# Altium schematic sheet PCB Schematic General Sheet.SchDoc: PCB Schematic General
size A3; DrawnBy: Group 31; Address1: ECE Department; Address2: University of Canterbury; Address3: Christchurch 8041; Address4: New Zealand; Revision: 1
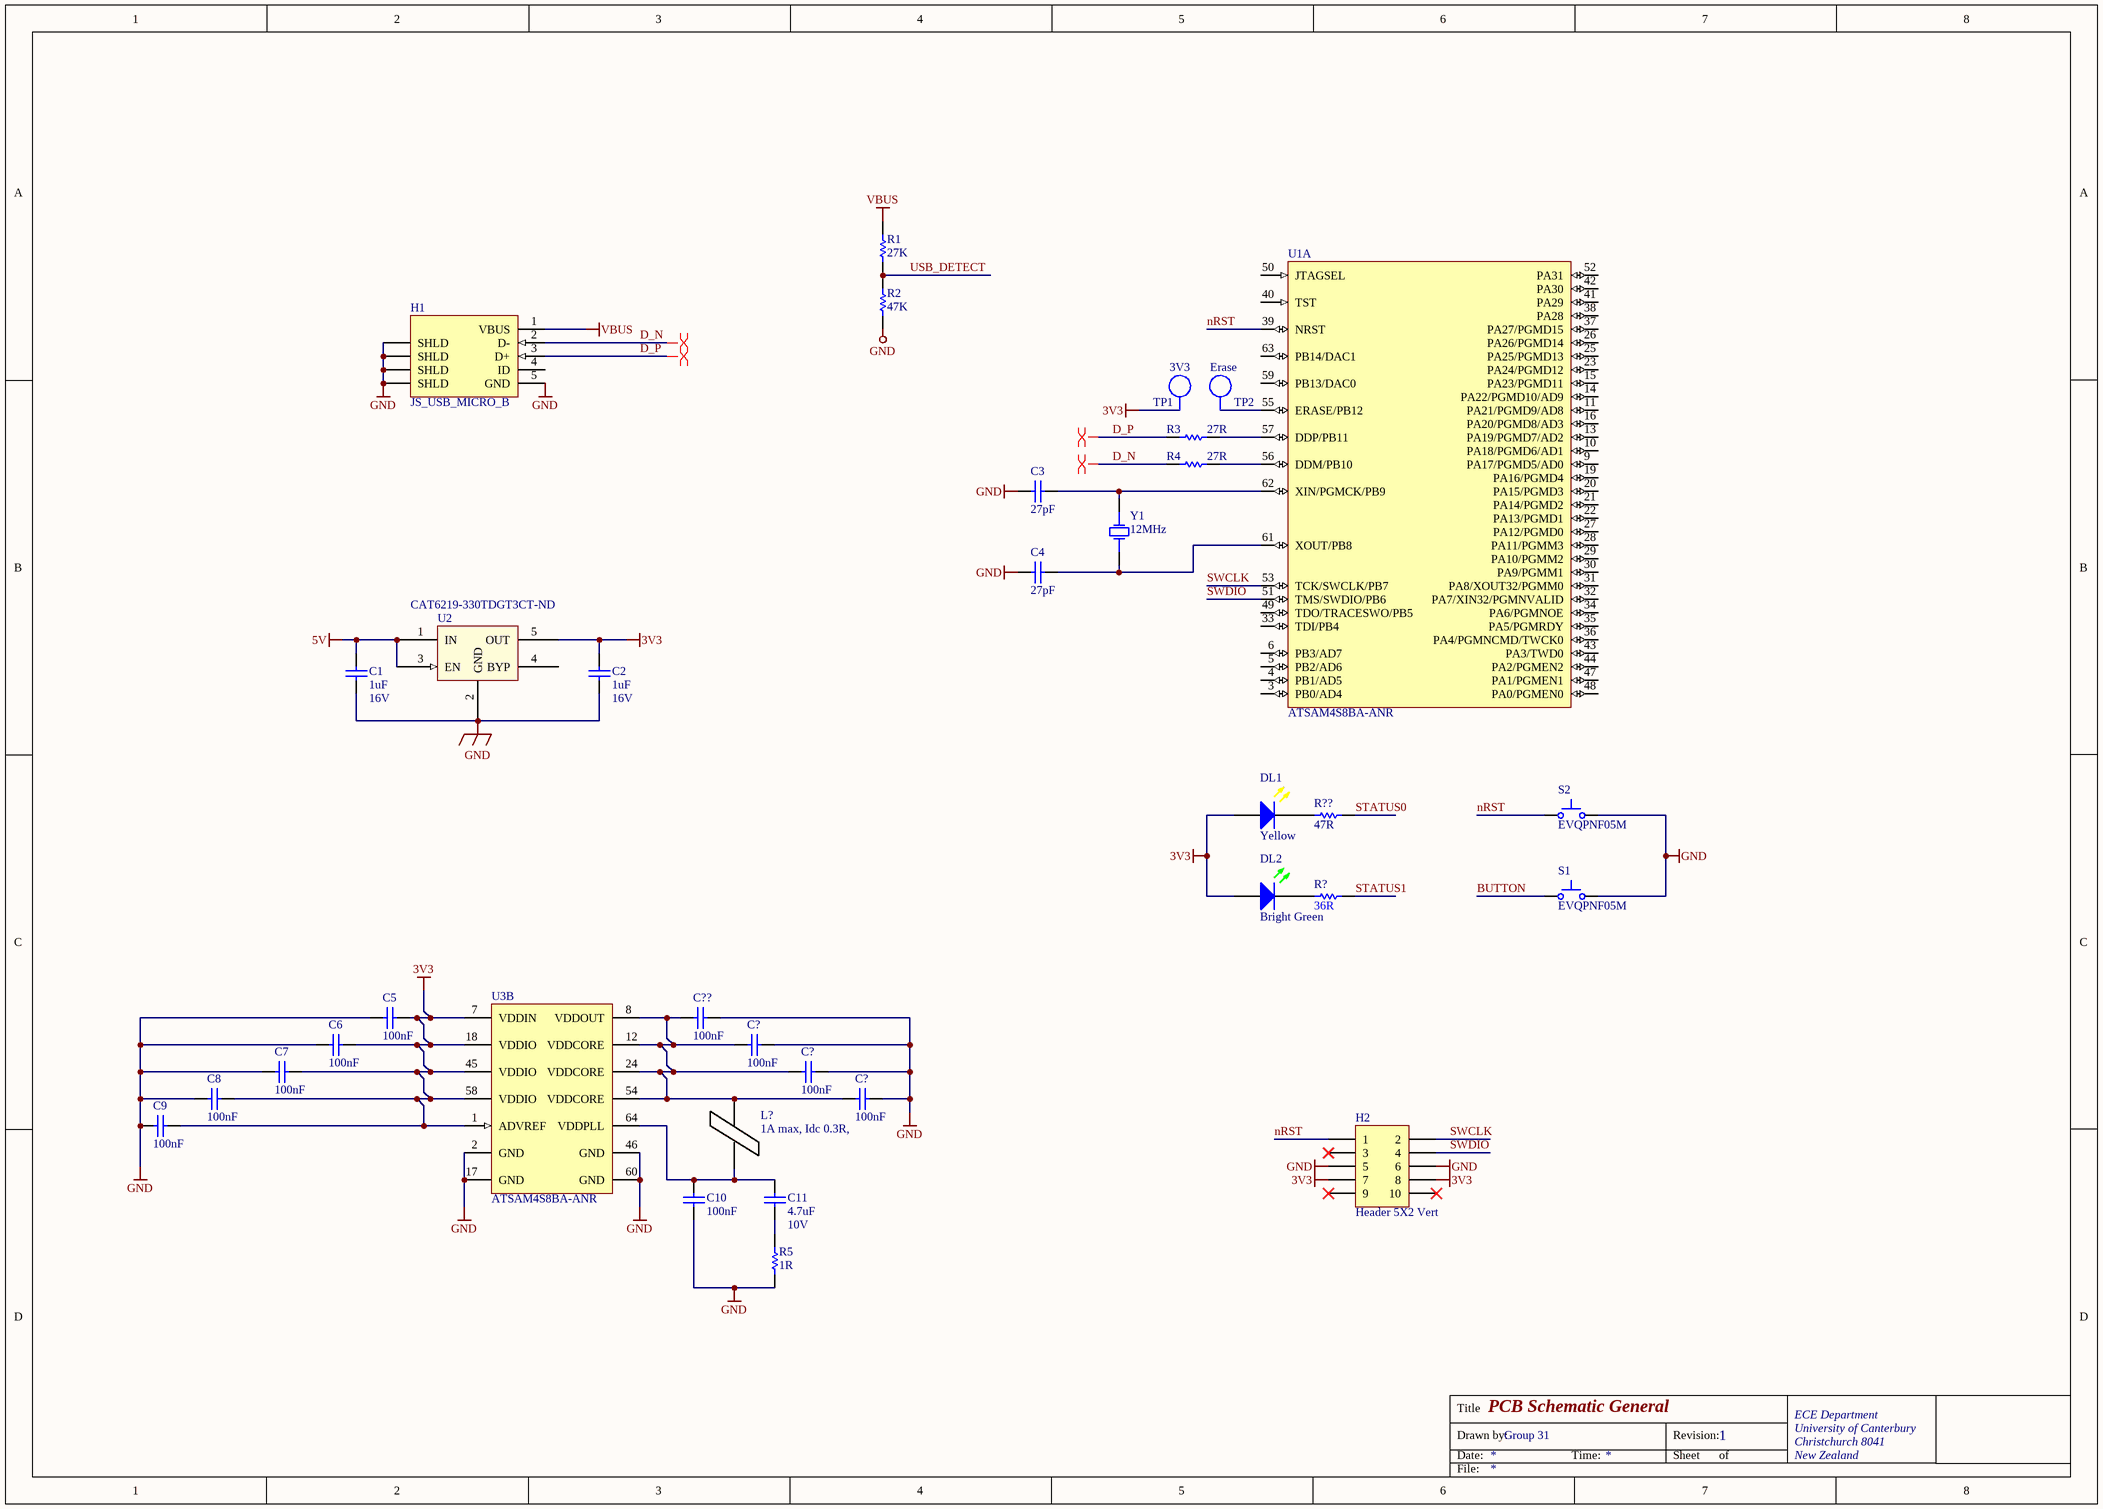
[diagram p0: PCB Schematic General Sheet.SchDoc]

## Parts
(Parts that share a designator on the sheet are numbered #1, #2 ... from top to bottom, then left to right.)
C1  Max Voltage: 16V  [CAPC1608L]  (hidden comment: 1uF)
C2  Max Voltage: 16V  [CAPC1608L]  (hidden comment: 1uF)
C3  27pF  [CAPC1608L]
C4  27pF  [CAPC1608L]
C5  100nF  [CAPC1608L]
C6  100nF  [CAPC1608L]
C7  100nF  [CAPC1608L]
C8  100nF  [CAPC1608L]
C9  100nF  [CAPC1608L]
C10  100nF  [CAPC1608L]
C11  Max Voltage: 10V  [CAPC1608N]  (hidden comment: 4.7uF)
C?#1  100nF  [CAPC1608L]
C?#2  100nF  [CAPC1608L]
C?#3  100nF  [CAPC1608L]
C??  100nF  [CAPC1608L]
DL1  Yellow  [WL-SMCW0603]
DL2  Bright Green  [WL-SMCW0603]
H1  JS_USB_MICRO_B  [FCI_USB_10118194-0001LF]
H2  Header 5X2 Vert  [IDC2.54-V10D]
L?  1A max, Idc 0.3R,  [INDC3216L]
R1  27K  [RESC1608L]
R2  47K  [RESC1608N]
R3  27R  [RESC1608L]
R4  27R  [RESC1608L]
R5  1R  [RESC3216L]
R?  36R  [RESC1608L]
R??  47R  [RESC1608L]
S1  EVQPNF05M  [EVQPNF05M]
S2  EVQPNF05M  [EVQPNF05M]
TP1  3V3  [TP_1206]  (no BOM)
TP2  Erase  [TP_1206]  (no BOM)
U1  ATSAM4S8BA-ANR  [LQFP64_L]  (part A of 2)
U2  Supplier Part Number: CAT6219-330TDGT3CT-ND  [SOT95P280X145-5N]  (hidden comment: CAT6219-330TDGT3)
U3  ATSAM4S8BA-ANR  [LQFP64_L]  (part B of 2)
Y1  12MHz  [6.0X3.5-4]

## Nets
3V3: C2.2 C5.2 C6.2 C7.2 C8.2 C9.2 DL1.2(A) DL2.2(A) H2.7 H2.8 TP1.1 U2.5(OUT) U3.1(ADVREF) U3.7(VDDIN) U3.18(VDDIO) U3.45(VDDIO) U3.58(VDDIO)
5V: C1.2 U2.1(IN) U2.3(EN)
GND: C1.1 C2.1 C3.1 C4.1 C5.1 C6.1 C7.1 C8.1 C9.1 C10.1 C?#1.2 C?#2.2 C?#3.2 C??.2 H1.5(GND) H1.6(SHLD) H2.5 H2.6 R2.1 R5.1 S1.2 S2.2 U2.2(GND) U3.2(GND) U3.17(GND) U3.46(GND) U3.60(GND)
VBUS: H1.1(VBUS) R1.2
BUTTON: S1.1
D_N: H1.2(D-) R4.1
D_P: H1.3(D+) R3.1
nRST: H2.1 S2.1 U1.39(NRST)
STATUS0: R??.2
STATUS1: R?.2
SWCLK: H2.2 U1.53(TCK/SWCLK/PB7)
SWDIO: H2.4 U1.51(TMS/SWDIO/PB6)
USB_DETECT: R1.1 R2.2
NetC3_2: C3.2 U1.62(XIN/PGMCK/PB9) Y1.1(OSC1)
NetC4_2: C4.2 U1.61(XOUT/PB8) Y1.3(OSC2)
NetC10_2: C10.2 C11.2 L?.1 U3.64(VDDPLL)
NetC11_1: C11.1 R5.2
NetC?#1_1: C?#1.1 C?#2.1 C?#3.1 C??.1 L?.2 U3.8(VDDOUT) U3.12(VDDCORE) U3.24(VDDCORE) U3.54(VDDCORE)
NetDL1_1: DL1.1(K) R??.1
NetDL2_1: DL2.1(K) R?.1
NetR3_2: R3.2 U1.57(DDP/PB11)
NetR4_2: R4.2 U1.56(DDM/PB10)
NetTP2_1: TP2.1 U1.55(ERASE/PB12)

Not connected (* = marked no-connect by the designer): H1 4(ID); H2 3* 9* 10*; U1 3(PB0/AD4) 4(PB1/AD5) 5(PB2/AD6) 6(PB3/AD7) 9(PA17/PGMD5/AD0) 10(PA18/PGMD6/AD1) 11(PA21/PGMD9/AD8) 13(PA19/PGMD7/AD2) 14(PA22/PGMD10/AD9) 15(PA23/PGMD11) 16(PA20/PGMD8/AD3) 19(PA16/PGMD4) 20(PA15/PGMD3) 21(PA14/PGMD2) 22(PA13/PGMD1) 23(PA24/PGMD12) 25(PA25/PGMD13) 26(PA26/PGMD14) 27(PA12/PGMD0) 28(PA11/PGMM3) 29(PA10/PGMM2) 30(PA9/PGMM1) 31(PA8/XOUT32/PGMM0) 32(PA7/XIN32/PGMNVALID) 33(TDI/PB4) 34(PA6/PGMNOE) 35(PA5/PGMRDY) 36(PA4/PGMNCMD/TWCK0) 37(PA27/PGMD15) 38(PA28) 40(TST) 41(PA29) 42(PA30) 43(PA3/TWD0) 44(PA2/PGMEN2) 47(PA1/PGMEN1) 48(PA0/PGMEN0) 49(TDO/TRACESWO/PB5) 50(JTAGSEL) 52(PA31) 59(PB13/DAC0) 63(PB14/DAC1); U2 4(BYP)

## Layout directives
differential pair: D_N, D_P

## Notes on the sheet
- Title
- Drawn by:
- Date:
- Time:
- Revision:
- Sheet
- of
- File:

## Library data of the parts
C1 C2 = CC_1uF_0603: CAP CER 1uF Y5V -20% +80% 16V 0603; PackageReference: 0603; Code_IPC: 1608 [0603]; Verify: *; Supplier: ECE Dept; Storage Location: PCB Assembly WS; Value: 1uF
C3 C4 = CC_27pF_0603: CAP CER 27pF NPO/COG +-5% 50V 0603; PackageReference: 0603; Code_IPC: 1608 [0603]; Verify: *; Supplier: ECE Dept; Storage Location: PCB Assembly WS; Value: 27pF
C5-C10 C?#1-C?#3 C?? = CC_100nF_0603: CAP CER 100nF X7R +-10% 50V 0603; PackageReference: 0603; Code_IPC: 1608 [0603]; Verify: *; Supplier: ECE Dept; Storage Location: PCB Assembly WS; Value: 100nF
C11 = CC_4.7uF_0603: CAP CER 4.7uF X5R +-20%  10V 0603; Note: Footprint corresponds to dimensions for bulk cassette packaging. This case size has tightened tolerances.; PackageReference: 0805; Code_IPC: 2012[0805]; Verify: *; Supplier: ECE Dept; Storage Location: PCB Assembly WS; Value: 4.7uF
DL1 = DL_150060YS75000: LED Yellow 120mcd 0603 SMD; Manufacturer: WURTH ELEKTRONIK; Forward Current If: 30; Forward Voltage: 2; Wavelength Typ: 590; Lens Shape: Rectangular; Viewing Angle: 140°; Luminous Intensity: 120; LED Mounting: SMD; Supplier 1: Farnell; Supplier Part Number 1: 2322074; Manufacturer Part Number: 150060YS75000; Storage Location: PCB Assembly WS; Supplier: ECE Dept; LED Colour: Yellow
DL2 = DL_150060VS75000: LED Bright Green 40mcd 0603 SMD; Manufacturer: WURTH ELEKTRONIK; Forward Current If: 30; Forward Voltage: 2; Viewing Angle: 140°; Wavelength Typ: 570; Luminous Intensity: 40; LED Mounting: SMD; Supplier 1: Farnell; Supplier Part Number 1: 2322073; Manufacturer Part Number: 150060VS75000; Storage Location: PCB Assembly WS; Supplier: ECE Dept; LED Colour: Bright Green
H1 = JS_USB_MICRO_B_SMT: CONN USB MICRO B RECPT SMT R/A; Manufacturer: FCI; Manufacturer Part Number: 10118194-0001LF; Gender: Receptacle; Number of Contacts: 5; Specifications: USB 2.0; Supplier 1: Digi-Key; Supplier Part Number 1: 609-4618-1-ND; Features: Shielded, Solder Retention; Mounting Type: Surface Mount, Right Angle, Horizontal
H2 = JA_HDR_IDC_5X2_VERT: IDC Header, 2,54mm, 10-Pin, Vert; Supplier: ECE Dept; Supplier 1: Farnell; Supplier Part Number 1: 1096985; Storage Location: ECE Dept Store
L? = IN_Ferrite-Bead: Ferrite Bead, Rdc 0.3R, Z100MHZ 600R, Imax 1A, SMD 1206; Manufacturer: FAIR-RITE; Manufacturer PN: 2512066017Y1; DC Current Rating: 1; DC Resistance Max: 0.08; Ferrite Case Style: 1206 ^3216 Metric]; Frequency Range: 50MHz to 1; Impedance: 600; Impedance Tolerance: ± 25%; Supplier: ECE Dept; Storage Location: PCB Assembly WS; Ferrite Mounting: SMD; Supplier 1: Farnell; Supplier Part Number 1: 1612060; Manufacturer Part Number: 2512066017Y1; Value: 1A max, Idc 0.3R,
R1 = RS_27K: RES 27K OHM 1/10W 5% 0603 SMD; Storage Location: PCB Assembly WS; Supplier: ECE Dept; Value: 27K
R2 = RS_47K: RES 47.0K OHM 1/10W 5% 0603 SMD; Storage Location: PCB Assembly WS; Supplier: ECE Dept; Value: 47K
R3 R4 = RS_27R: RES 27 OHM 1/10W 5% 0603 SMD; Storage Location: PCB Assembly WS; Supplier: ECE Dept; Value: 27R
R5 = RT_1R: RES 1R OHM 1/4W 5% 1206 SMD; Storage Location: PCB Assembly WS; Supplier: ECE Dept; Value: 1R
R? = RS_36R: RES 36 OHM 1/10W 5% 0603 SMD; Storage Location: PCB Assembly WS; Supplier: ECE Dept; Value: 36R
R?? = RS_47R: RES 47 OHM 1/10W 5% 0603 SMD; Storage Location: PCB Assembly WS; Supplier: ECE Dept; Value: 47R
S1 S2 = WS_EVQPNF05M: Panasonic 6 x 3.5mm SMD Light Touch Switch Type SMD; PackageDescription: 6.0 x 3.5 mm; Supplier 1: Farnell; Supplier Part Number 1: 2079481; Manufacturer: Panasonic; Manufacturer PN: EVQPNF05M; Supplier 2: Digi-Key; Supplier Part Number 2: P13598SCT-ND; Storage Location: PCB Assembly WS; Supplier: ECE Dept
TP1 TP2 = TP_1206: Test-Point 3.3x1.6x2.1mm SMD; Manufacturer: Harwin Inc; Manufacturer Part Number: S1751-46R; Value: TP; Manufacturer PN: *; Storage Location: ProtoPlace; Mounting Type: Surface Mount; Type: PC Test Point; Supplier 1: Digi-Key; Supplier Part Number 1: 952-1478-2-ND; Supplier 2: Farnell; Supplier Part Number 2: 1826282; Supplier: ECE Dept
U1 U3 = SE_ATSAM4S16BA-MU: IC MCU 32BIT 512KB FLASH 64LQFP; Manufacturer: Atmel; Connectivity: I²C, IrDA, Memory Card, SPI, SSC, UART/USART, USB; Core Processor: ARM® Cortex®-M4; Core Size: 32-Bit; Data Converters: A/D 11x12b, D/A 2x12b; Number of I/O: 47; Peripherals: Brown-out Detect/Reset, DMA, POR, PWM, WDT; Program Memory Size: 512KB (512K x 8); RAM Size: 128K x 8; Speed: 120MHz; Voltage - Supply (Vcc/Vdd): 1.62 V ~ 3.6 V; PackageVersion: revJ, Jul-2007; PackageReference: 64PS; PackageDescription: 64-Pin Quad Flat No-Lead (QFN) Sawn, 9 x 9 x 1.0 mm Body, 0.5 mm Pitch, Exposed Pad; Code_JEDEC: MO-220VMMD-3; ComponentLink1Description: Manufacturer URL; ComponentLink1URL: http://www.atmel.com/; ComponentLink2Description: SAM4S Series Datasheet; ComponentLink2URL: http://www.atmel.com/dyn/resources/prod_documents/11100.pdf; ComponentLink3Description: SAM4S Series Summary; ComponentLink3URL: http://www.atmel.com/dyn/resources/prod_documents/11100S.pdf; Supplier 1: Digi-Key; Package / Case: 64-LQFP; Packaging: Cut Tape (CT); Program Memory Type: FLASH; Supplier Part Number 1: ATSAM4S8BA-ANRCT-ND; Manufacturer Part Number: ATSAM4S8BA-ANR
U2 = SV_CAT6219-330TDGT3: IC REG LIN 3.3V 500MA TSOT23-5; Voltage - Input (Max): 5.5V; Voltage Dropout (Max): 0.5V @ 500mA; Manufacturer Part Number: CAT6219-330TDGT3; Base Part Number: CAT6219; Current - Output: 500mA; Package / Case: SOT-23-5 Thin, TSOT-23-5; Supplier: Digi-Key; Supplier Device Package: TSOT-23-5; Voltage - Output (Min/Fixed): 3.3V; ComponentLink1URL: http://www.onsemi.com/pub/Collateral/CAT6219-D.PDF; ComponentLink1Description: http://www.onsemi.com/pub/Collateral/CAT6219-D.PDF; Supplier 1: Digi-Key
Y1 = XT_CRYSTAL_12MHz_18pF: CRYSTAL 12MHZ 18PF 6X3.5mm SMD; Manufacturer: CTS-Frequency Controls; Manufacturer Part Number: 406C35D12M00000; ESR (Equivalent Series Resistance): 60 Ohm; Frequency Stability: ±50ppm; Frequency Tolerance: ±30ppm; Operating Mode: Fundamental; Supplier 1: Digi-Key; Height: 0.047" (1.20mm); Load Capacitance: 18pF; Mounting Type: Surface Mount; Operating Temperature: -20°C ~ 70°C; Package / Case: 4-SMD, No Lead (DFN, LCC); Size / Dimension: 0.236" L x 0.138" W (6.00mm x 3.50mm); Supplier Part Number 1: CTX855CT-ND; Frequency: 12MHz